# Altium schematic sheet switch.SchDoc
size A4
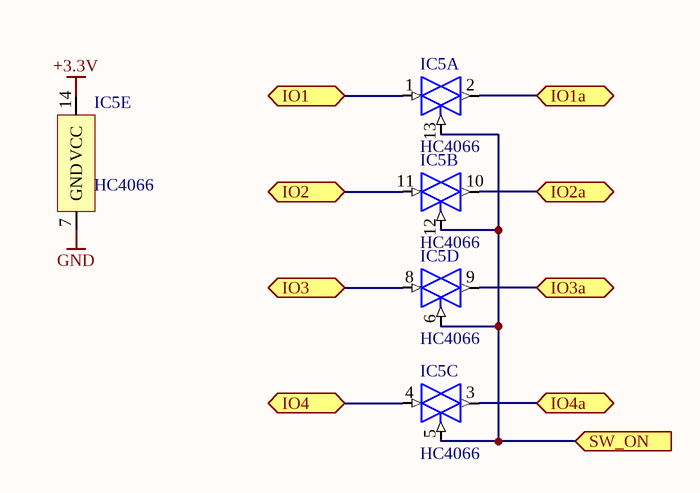
[diagram p0: switch.SchDoc]

## Parts
IC5  HC4066  [SO-14]  (parts A,B,C,D,E of 5)

## Ports
IO1 (bidir), IO1a (bidir), IO2 (bidir), IO2a (bidir), IO3 (bidir), IO3a (bidir), IO4 (bidir), IO4a (bidir), SW_ON (in)

## Nets
+3.3V: IC5.14(VCC)
GND: IC5.7(GND)
IO1: IC5.1 ; port IO1
IO1a: IC5.2 ; port IO1a
IO2: IC5.11 ; port IO2
IO2a: IC5.10 ; port IO2a
IO3: IC5.8 ; port IO3
IO3a: IC5.9 ; port IO3a
IO4: IC5.4 ; port IO4
IO4a: IC5.3 ; port IO4a
SW_ON: IC5.5 IC5.6 IC5.12 IC5.13 ; port SW_ON

## Library data of the parts
IC5 = 4066: CMOS switches